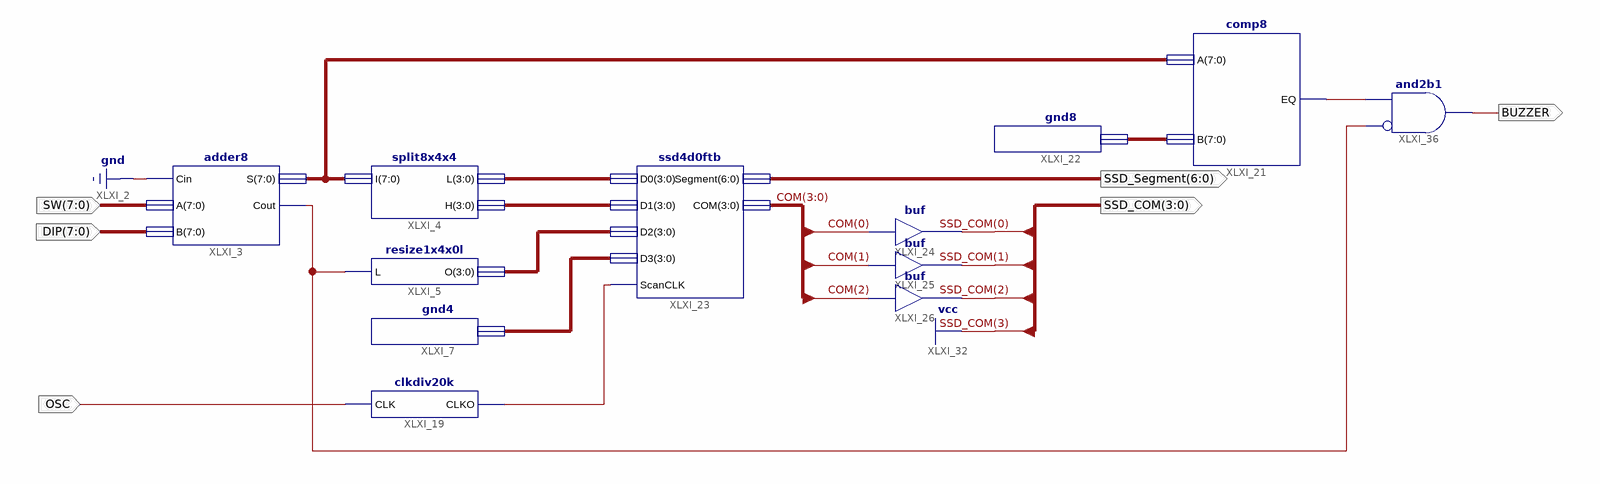
[diagram p0: schematic sheet 1]
// Xilinx ISE schematic main.sch (spartan6) as structural Verilog: 12 symbols, 6 ports
module main (
  input  [7:0] SW,
  input  [7:0] DIP,
  input  OSC,
  output [6:0] SSD_Segment,
  output [3:0] SSD_COM,
  output BUZZER
);

  wire XLXN_3, XLXN_27, XLXN_90;
  wire [3:0] COM, XLXN_9, XLXN_10, XLXN_11, XLXN_12;
  wire [7:0] XLXN_4, XLXN_29;

  adder8 XLXI_3 (.A(SW), .B(DIP), .Cin(1'b0), .Cout(XLXN_3), .S(XLXN_4));
  split8x4x4 XLXI_4 (.H(XLXN_11), .I(XLXN_4), .L(XLXN_12));
  gnd4 XLXI_7 (.GND(XLXN_9));
  resize1x4x0l XLXI_5 (.L(XLXN_3), .O(XLXN_10));
  clkdiv20k XLXI_19 (.CLK(OSC), .CLKO(XLXN_27));
  comp8 XLXI_21 (.A(XLXN_4), .B(XLXN_29), .EQ(XLXN_90));
  gnd8 XLXI_22 (.GND(XLXN_29));
  ssd4d0ftb XLXI_23 (
    .COM(COM), .D0(XLXN_12), .D1(XLXN_11), .D2(XLXN_10), .D3(XLXN_9), .ScanCLK(XLXN_27), .Segment(SSD_Segment));
  buf XLXI_24 (SSD_COM[0], COM[0]);
  buf XLXI_25 (SSD_COM[1], COM[1]);
  buf XLXI_26 (SSD_COM[2], COM[2]);
  and XLXI_36 (BUZZER, ~XLXN_3, XLXN_90);  // and2b1

  assign SSD_COM[3] = 1'b1;
endmodule
